# EAGLE design siren (EAGLE 7.5.0)
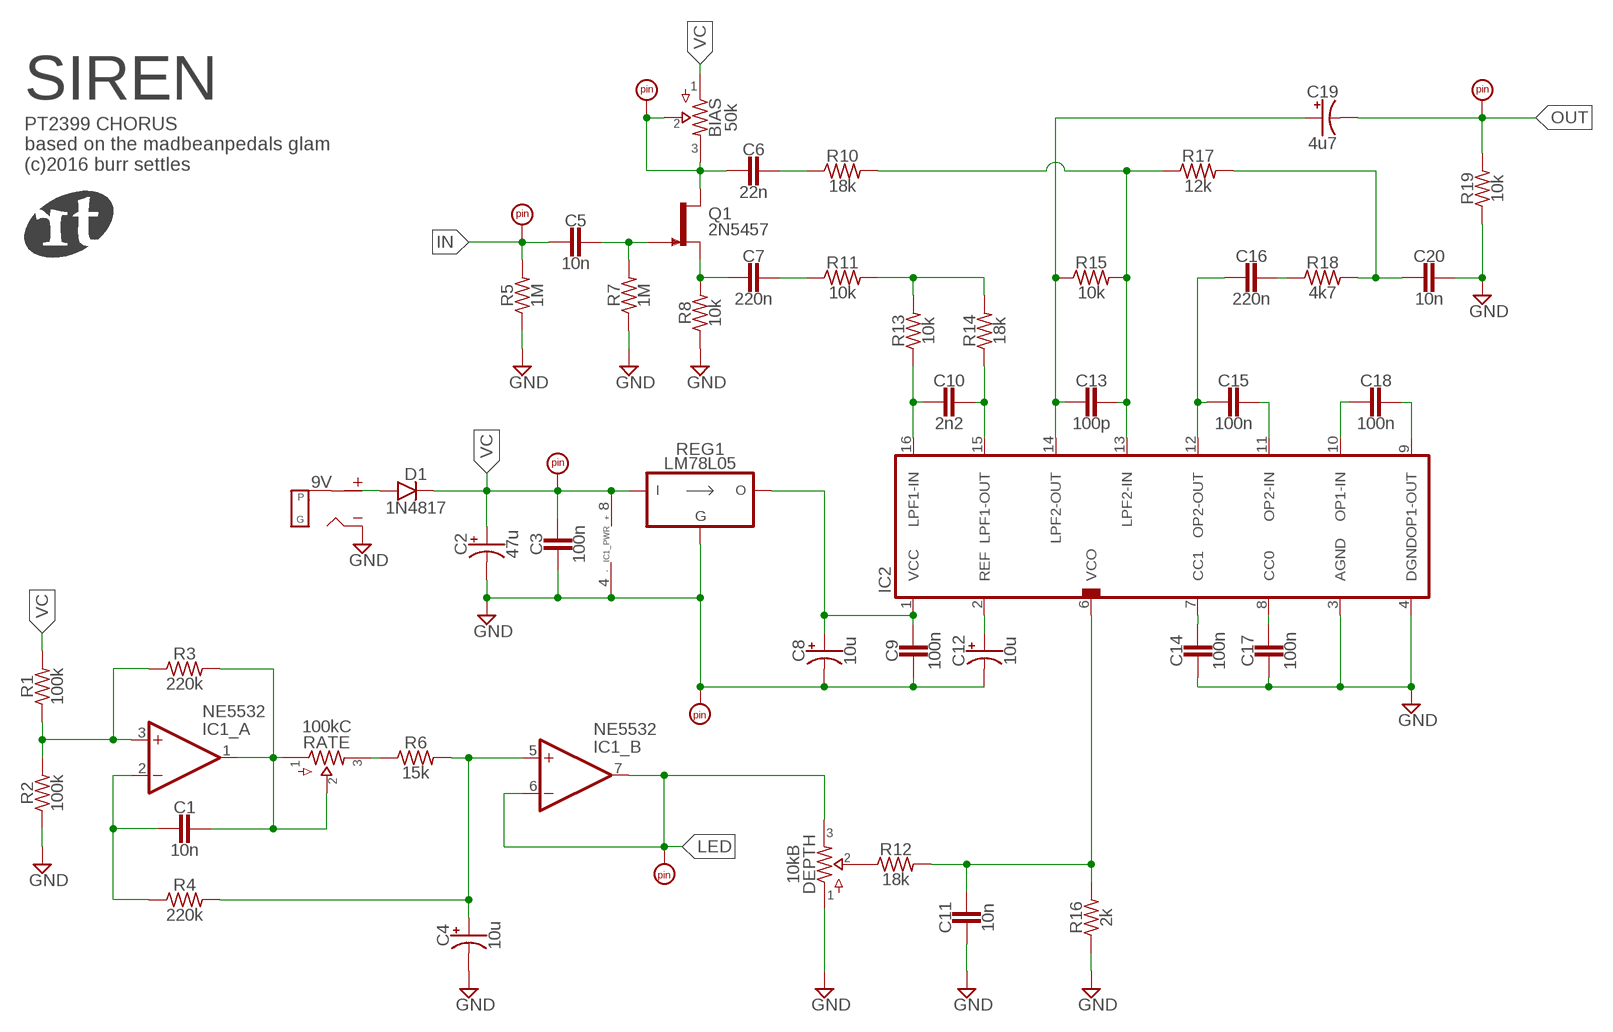
[diagram p0: schematic, sheet 1]

## Parts
9V  DC_MONO  [DC]
BIAS  50k  POTSTRIM  [2262_TRIM]
C1  10n  CER/FILM2  [050X030_025_2]
C2  47u  0501  [050_020_1]
C3  100n  CER/FILM2  [050X030_025_2]
C4  10u  0501  [050_020_1]
C5  10n  CER/FILM2  [050X030_025_2]
C6  22n  CER/FILM2  [050X030_025_2]
C7  220n  CER/FILM2  [050X030_025_2]
C8  10u  0500  [050_020]
C9  100n  CER/FILM2  [050X030_025_2]
C10  2n2  CER/FILM2  [050X030_025_2]
C11  10n  CER/FILM2  [050X030_025_2]
C12  10u  0501  [050_020_1]
C13  100p  CER/FILM2  [050X030_025_2]
C14  100n  CER/FILM2  [050X030_025_2]
C15  100n  CER/FILM2  [050X030_025_2]
C16  220n  CER/FILM2  [050X030_025_2]
C17  100n  CER/FILM2  [050X030_025_2]
C18  100n  CER/FILM2  [050X030_025_2]
C19  4u7  0501  [050_020_1]
C20  10n  CER/FILM2  [050X030_025_2]
D1  1N4817  DO41.3  [DO41-3]
DEPTH  10kB  POTSTRIM  [2262_TRIM]
GND  PADRND  [ROUND]
IC1  NE5532  DUALTH  [DIL08]
IC2  PT2399TH  [DIL16]
IN  PADSQR  [SQUARE]
L+  PADSQR  [SQUARE]
OUT  PADSQR  [SQUARE]
PAD1  PAD  [UNLABELED]
PAD2  PAD  [UNLABELED]
Q1  2N5457  [TO92-]
R1  100k  R_.2  [R0207/2V]
R2  100k  R_.2  [R0207/2V]
R3  220k  R_.2  [R0207/2V]
R4  220k  R_.2  [R0207/2V]
R5  1M  R_.2  [R0207/2V]
R6  15k  R_.2  [R0207/2V]
R7  1M  R_.2  [R0207/2V]
R8  10k  R_.2  [R0207/2V]
R10  18k  R_.2  [R0207/2V]
R11  10k  R_.2  [R0207/2V]
R12  18k  R_.2  [R0207/2V]
R13  10k  R_.2  [R0207/2V]
R14  18k  R_.2  [R0207/2V]
R15  10k  R_.2  [R0207/2V]
R16  2k  R_.2  [R0207/2V]
R17  12k  R_.2  [R0207/2V]
R18  4k7  R_.2  [R0207/2V]
R19  10k  R_.2  [R0207/2V]
RATE  100kC  POTSSMALL_PADS  [PADS_SMALL]
REG1  LM78L05  [TO92-]

## Nets
+9V: 9V.T(TIP) D1.A
GND: 9V.S(SLEEVE) C2.- C3.2 C4.- C8.- C9.2 C11.2 C12.- C14.2 C17.2 C20.1 DEPTH.1 GND.1 IC1.4(_PWR:V-) IC2.3(AGND) IC2.4(DGND) R2.1 R5.1 R7.1 R8.1 R16.1 R19.1 REG1.2(GND)
IN: C5.2 IN.1 R5.2
LED: DEPTH.3 IC1.6(_B:-IN) IC1.7(_B:OUT) L+.1
N$1: C13.1 IC2.13(LPF2-IN) R10.2 R15.2 R17.1
N$3: C8.+ C9.1 IC2.1(VCC) REG1.3(VO)
N$4: C10.2 IC2.16(LPF1-IN) R13.1
N$5: C10.1 IC2.15(LPF1-OUT) R14.1
N$6: C20.2 R17.2 R18.2
N$7: C12.+ IC2.2(REF)
N$8: C14.1 IC2.7(CC1)
N$9: C17.1 IC2.8(CC0)
N$10: C15.1 IC2.11(OP2-IN)
N$11: C18.2 IC2.10(OP1-IN)
N$12: C18.1 IC2.9(OP1-OUT)
N$13: C13.2 C19.+ IC2.14(LPF2-OUT) R15.1
N$15: R11.2 R13.2 R14.2
N$16: C7.1 R11.1
N$17: C7.2 Q1.2(S) R8.2
N$18: C6.1 R10.1
N$19: BIAS.2 BIAS.3 C6.2 PAD2.P$1 Q1.3(D)
N$20: C5.1 Q1.1(G) R7.2
N$21: IC1.3(_A:+IN) R1.1 R2.2 R3.1
N$22: C15.2 C16.2 IC2.12(OP2-OUT)
N$23: C16.1 R18.1
N$24: C1.1 IC1.1(_A:OUT) R3.2 RATE.1 RATE.2
N$25: C1.2 IC1.2(_A:-IN) R4.1
N$26: DEPTH.2 R12.1
N$27: R6.1 RATE.3
N$28: C4.+ IC1.5(_B:+IN) R4.2 R6.2
N$31: C11.1 IC2.6(VCO) R12.2 R16.2
OUT: C19.- OUT.1 R19.2
VC: BIAS.1 C2.+ C3.1 D1.C IC1.8(_PWR:V+) PAD1.P$1 R1.2 REG1.1(VI)

## Notes on the sheet
- SIREN
- PT2399 CHORUS
  based on the madbeanpedals glam
  (c)2016 burr settles

## Library data of the parts
9V = jacks:DC_MONO
BIAS DEPTH RATE = potentiometers:POTS
C1 C3 C5-C7 C9-C11 C13-C18 C20 = capacitors-film:CER/FILM: 47 - 120pF Xicon Ceramic Disc 2.5mm lead spacing
C2 C4 C8 C12 C19 = capacitors-elec:050: 0.22 - 100uF Xicon values at Mouser.com: 10V: 10 - 100uF; 16V: 2.2 - 47uF; 25V: 0.47 - 47uF; 50V: 0.22 - 22uF
D1 = diodes:DO41: DO-41 Package Diodes: 1N4001 - 1N40019 Zener Diodes: 1N4728 - 1N4764
GND IN L+ OUT PAD1 PAD2 = supply pins:PAD
IC1 = integrated circuits:DUAL: OP AMP
IC2 = integrated circuits:PT2399: Echo Processor IC
Q1 = transistors:2N5457: N-CHANNEL JFET
R1-R8 R10-R19 = resistors:R_
REG1 = regulators:LM78L05

## Board
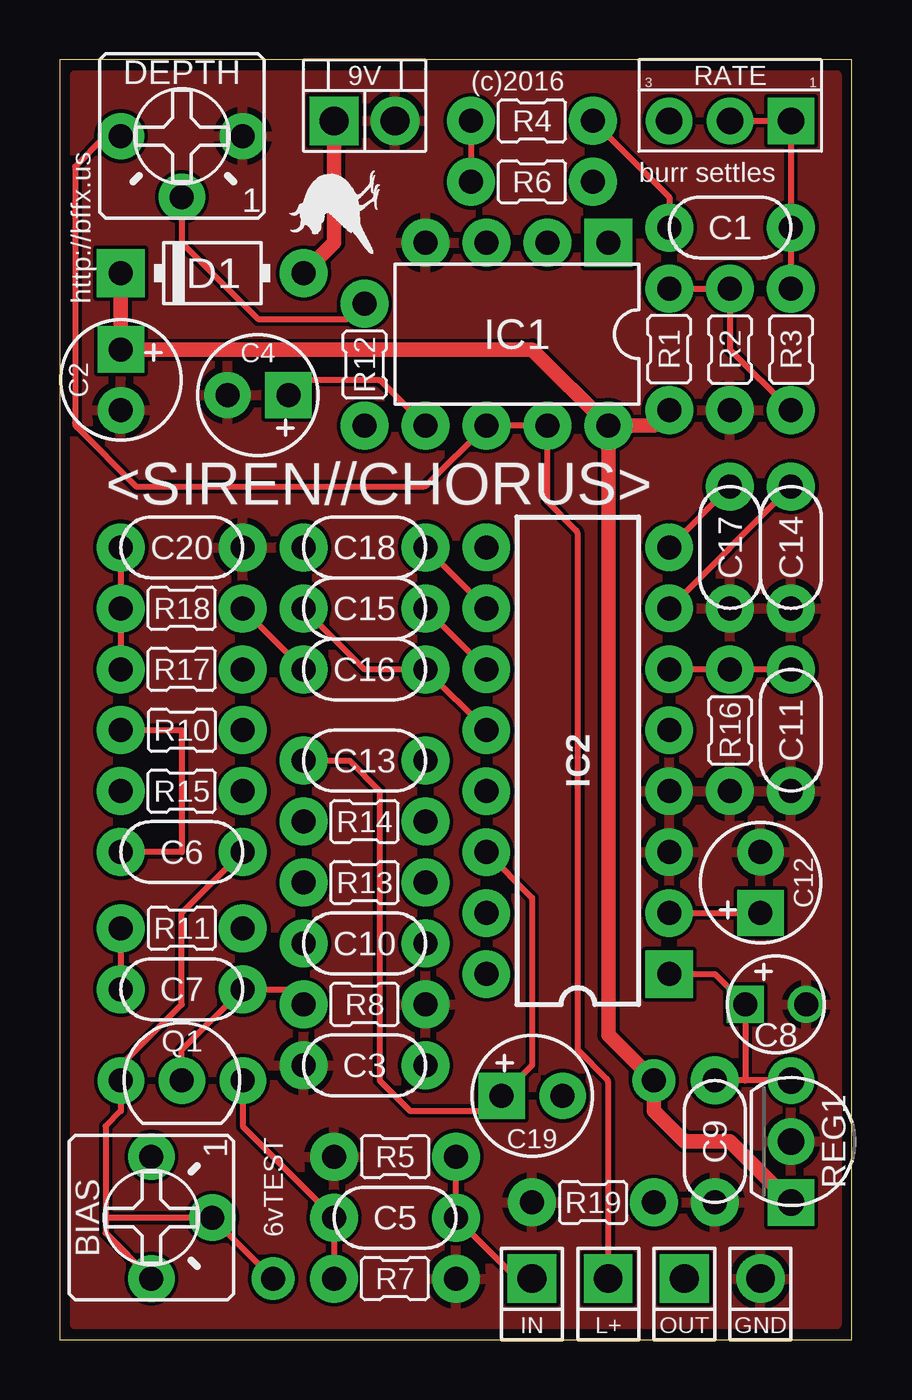
[diagram p1: board, top side]
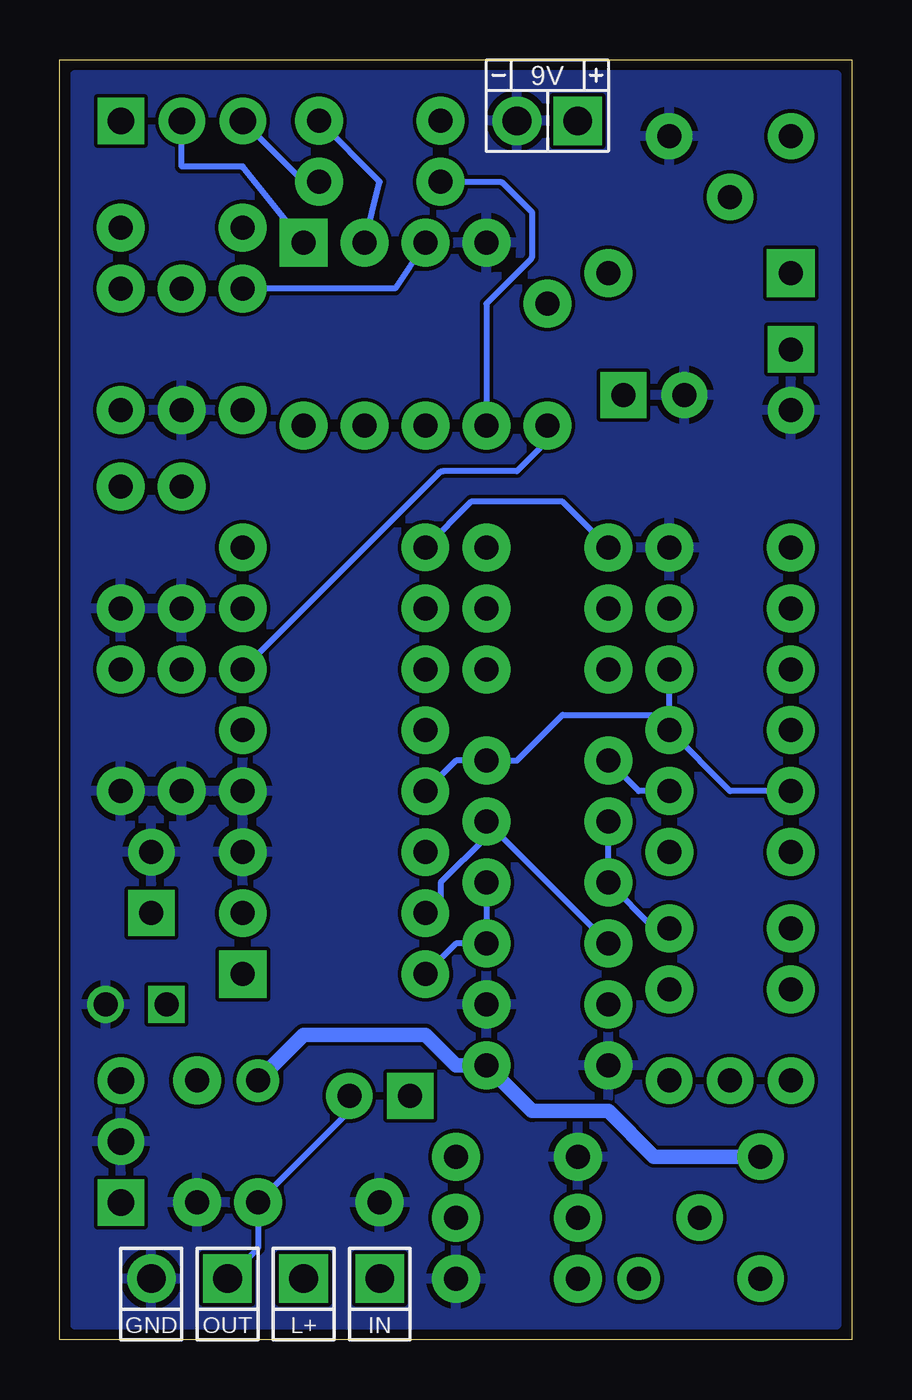
[diagram p2: board, bottom side, seen from below]

Size 33.02 x 53.34 mm. Coordinates in mm from the lower left corner, seen from the top.
Outline: 0,0 33.02,0 33.02,53.34 0,53.34 0,0
Copper layers (1*16): Top 0.0356mm / dielectric 1.5011mm / Bottom 0.0356mm
Design rules "oshpark-2layer": minimum track width 6mil, minimum drill 13mil, track to track 6mil, track to pad 6mil, pad to pad 6mil, via to via 6mil, smd to smd 6mil, copper to edge 15mil, drill to drill 6mil, minimum pad ring 7mil, minimum via ring 7mil, stop-mask expansion 2.5mil, vias tented up to drill 0mil, thermal gap 10mil

### Footprints (pad centres in the part's own frame; a part is rotated, then mirrored left to right if it is on the bottom)
DC = drill 1.2 pad 2.032: S -1.27,0 | drill 1.2 pad 2.032 square: T 1.27,0
2262_TRIM = drill 1 pad 1.93: 1 -2.54,0; 2 0,2.54; 3 2.54,0
050X030_025_2 = drill 1 pad 2: 1 -2.54,0; 2 2.54,0
050_020_1 = drill 1 pad 1.93 square: + -1.27,0 | drill 1 pad 1.93: - 1.27,0
050_020 = drill 1 pad 1.524 square: + -1.27,0 | drill 1 pad 1.524: - 1.27,0
DO41-3 = drill 1 pad 2: A 3.81,0 | drill 1 pad 2 square: C -3.81,0
ROUND = drill 1.2 pad 2.032: 1 0,0
DIL08 = drill 1 pad 2 square: 1 -3.81,-3.81 | drill 1 pad 2: 2 -1.27,-3.81; 3 1.27,-3.81; 4 3.81,-3.81; 5 3.81,3.81; 6 1.27,3.81; 7 -1.27,3.81; 8 -3.81,3.81
DIL16 = drill 1 pad 1.981 square: 1 -8.89,-3.81 | drill 1 pad 1.981: 2 -6.35,-3.81; 3 -3.81,-3.81; 4 -1.27,-3.81; 5 1.27,-3.81; 6 3.81,-3.81; 7 6.35,-3.81; 8 8.89,-3.81; 9 8.89,3.81; 10 6.35,3.81; 11 3.81,3.81; 12 1.27,3.81; 13 -1.27,3.81; 14 -3.81,3.81; 15 -6.35,3.81; 16 -8.89,3.81
SQUARE = drill 1.2 pad 2.032 square: 1 0,0
UNLABELED = drill 1 pad 1.778: P$1 0,0
TO92- = drill 1 pad 1.93: 1 2.54,0; 2 0,0; 3 -2.54,0
R0207/2V = drill 1 pad 2: 1 -2.54,0; 2 2.54,0
PADS_SMALL = drill 1.1 pad 1.93 square: 1 2.54,0 | drill 1.1 pad 1.93: 2 0,0; 3 -2.54,0
TO92-' = drill 1.1 pad 1.93 square: 1 -2.54,0 | drill 1.1 pad 1.93: 2 0,0; 3 2.54,0

### Placement (x,y rotation side)
9V  12.7,50.8 0 bottom
BIAS  3.81,5.08 270 top
C1  27.94,46.35 180 top
C2  2.54,40.01 270 top
C3  12.7,11.43 180 top
C4  8.26,39.37 180 top
C5  13.97,5.08 0 top
C6  5.08,20.32 0 top
C7  5.08,14.61 0 top
C8  29.84,13.97 0 top
C9  27.3,8.26 270 top
C10  12.7,16.51 0 top
C11  30.48,25.4 270 top
C12  29.21,19.05 90 top
C13  12.7,24.13 180 top
C14  30.48,33.02 270 top
C15  12.7,30.48 180 top
C16  12.7,27.94 0 top
C17  27.94,33.02 270 top
C18  12.7,33.02 0 top
C19  19.68,10.16 0 top
C20  5.08,33.02 180 top
D1  6.35,44.45 0 top
DEPTH  5.08,50.16 180 top
GND  29.21,2.54 0 top
IC1  19.05,41.91 180 top
IC2  21.59,24.13 90 top
IN  19.68,2.54 0 top
L+  22.86,2.54 0 top
OUT  26.04,2.54 0 top
PAD1  24.77,10.79 0 top
PAD2  8.89,2.54 0 top
Q1  5.08,10.79 0 top
R1  25.4,41.27 270 top
R2  27.94,41.27 90 top
R3  30.48,41.27 90 top
R4  19.68,50.8 180 top
R5  13.97,7.62 0 top
R6  19.68,48.26 180 top
R7  13.97,2.54 180 top
R8  12.7,13.97 180 top
R10  5.08,25.4 0 top
R11  5.08,17.14 0 top
R12  12.7,40.64 270 top
R13  12.7,19.05 180 top
R14  12.7,21.59 180 top
R15  5.08,22.86 180 top
R16  27.94,25.4 90 top
R17  5.08,27.94 180 top
R18  5.08,30.48 180 top
R19  22.23,5.71 0 top
RATE  27.94,50.8 0 top
REG1  LM78L05  [TO92-']  30.48,8.26 90 top
U$1  [BF0150]  11.43,46.99 90 top

### Tracks (layer width: path | path; a pad name or v marks a point on that pad's centre or on a via)
+9V
  Top 0.61: 9V.T 11.43,45.72 D1.A
GND
  pour Top: 0.64,52.7 32.38,52.7 32.38,0.64 0.64,0.64
  pour Bottom: 0.64,52.7 32.38,52.7 32.38,0.64 0.64,0.64
IN
  Top 0.254: IN.1 19.05,2.54 C5.2 R5.2
LED
  Top 0.254: DEPTH.3 2.01,50.16 arc45 1.83,50.09 0.64,48.9 0.64,38.2 arc45 0.71,38.03 3.17,35.56 15.13,35.56 arc45 15.31,35.63 IC1.6 IC1.7 20.32,34.92 21.52,33.73 arc-45 21.59,33.55 21.59,12.06 22.79,10.87 arc-45 22.86,10.69 L+.1
N$1
  Bottom 0.254: R15.2 5.08,22.86 R10.2 | R10.2 R17.1 | IC2.13 16.51,24.13 C13.1 13.97,24.13 12.06,26.04 8.26,26.04 R10.2
N$3
  Top 0.254: REG1.3 28.57,10.79 | 28.57,10.79 C9.1 | IC2.1 27.3,15.24 C8.+ 28.57,10.79
N$4
  Bottom 0.254: R13.1 C10.2 16.51,16.51 IC2.16
N$5
  Bottom 0.254: C10.1 R14.1 15.24,20.95 17.14,19.05 17.14,18.41 IC2.15
N$6
  Top 0.254: C20.2 R18.2 R17.2
N$7
  Top 0.254: IC2.2 C12.+
N$8
  Top 0.254: IC2.7 C14.1
N$9
  Top 0.254: IC2.8 C17.1
N$10
  Top 0.254: IC2.11 C15.1
N$11
  Top 0.254: IC2.10 C18.2
N$12
  Bottom 0.254: C18.1 12.06,34.92 15.88,34.92 IC2.9
N$13
  Top 0.254: IC2.14 19.68,18.41 19.68,11.43 C19.+ 17.78,9.53 14.61,9.53 13.34,10.79 13.34,22.86 12.06,24.13 C13.2
  Bottom 0.254: R15.1 8.89,22.86 C13.2
N$15
  Bottom 0.254: R11.2 8.26,17.14 R13.2 R14.2
N$16
  Top 0.254: R11.1 C7.1
N$17
  Top 0.254: Q1.2 5.08,12.06 C7.2 9.53,14.61 R8.2
N$18
  Top 0.254: R10.1 5.08,25.4 5.08,20.32 C6.1
N$19
  Top 0.254: PAD2.P$1 BIAS.2 1.91,5.08 | C6.2 5.08,17.78 5.08,13.97 2.54,11.43 Q1.3 2.54,9.53 1.91,8.89 1.91,5.08 | 1.91,5.08 1.91,4.45 BIAS.3
N$20
  Top 0.254: Q1.1 7.62,8.89 C5.1 R7.2
N$21
  Top 0.254: R1.1 R2.2 27.94,41.27 R3.1
  Bottom 0.254: IC1.3 19.05,43.81 R1.1
N$22
  Top 0.254: IC2.12 C16.2 12.7,27.94 C15.2
N$23
  Top 0.254: R18.1 C16.1
N$24
  Top 0.254: RATE.2 RATE.1 C1.1 R3.2
  Bottom 0.254: IC1.1 25.4,48.9 27.94,48.9 RATE.2
N$25
  Top 0.254: R4.1 25.4,47.62 C1.2
  Bottom 0.254: IC1.2 19.68,48.26 R4.1
N$26
  Top 0.254: DEPTH.2 5.08,45.83 arc45 5.15,45.65 8.26,42.55 11.96,42.55 arc45 12.14,42.62 R12.1
N$27
  Bottom 0.254: R6.1 22.86,48.26 RATE.3
N$28
  Top 0.254: R4.2 R6.2 | C4.+ 10.16,40.01 13.23,40.01 arc-45 13.41,39.93 IC1.5
  Bottom 0.254: R6.2 14.71,48.26 arc45 14.53,48.19 13.34,46.99 13.34,45.19 arc45 13.41,45.01 15.24,43.18 IC1.5
N$31
  Top 0.254: C11.1 R16.2 IC2.6
  Bottom 0.254: R12.2 12.7,37.57 arc45 12.77,37.39 13.97,36.2 17.04,36.2 arc-45 17.22,36.12 IC2.6
OUT
  Bottom 0.254: C19.- 20.95,9.53 R19.2 24.77,3.81 OUT.1
VC
  Top 0.61: IC1.8 24.77,38.1 R1.2 | IC1.8 22.86,12.7 PAD1.P$1 24.77,9.53 26.04,8.26 27.94,8.26 REG1.1 | D1.C C2.+ 19.68,41.27 IC1.8
  Bottom 0.61: BIAS.1 8.26,7.62 10.16,9.53 13.34,9.53 C3.1 16.51,11.43 17.78,12.7 22.86,12.7 PAD1.P$1

### Text on the board
tNames: (c)2016 | burr settles | http://bffx.us | <SIREN//CHORUS> | 6vTEST